# EAGLE design hzbcpu1 (EAGLE 7.6.0)
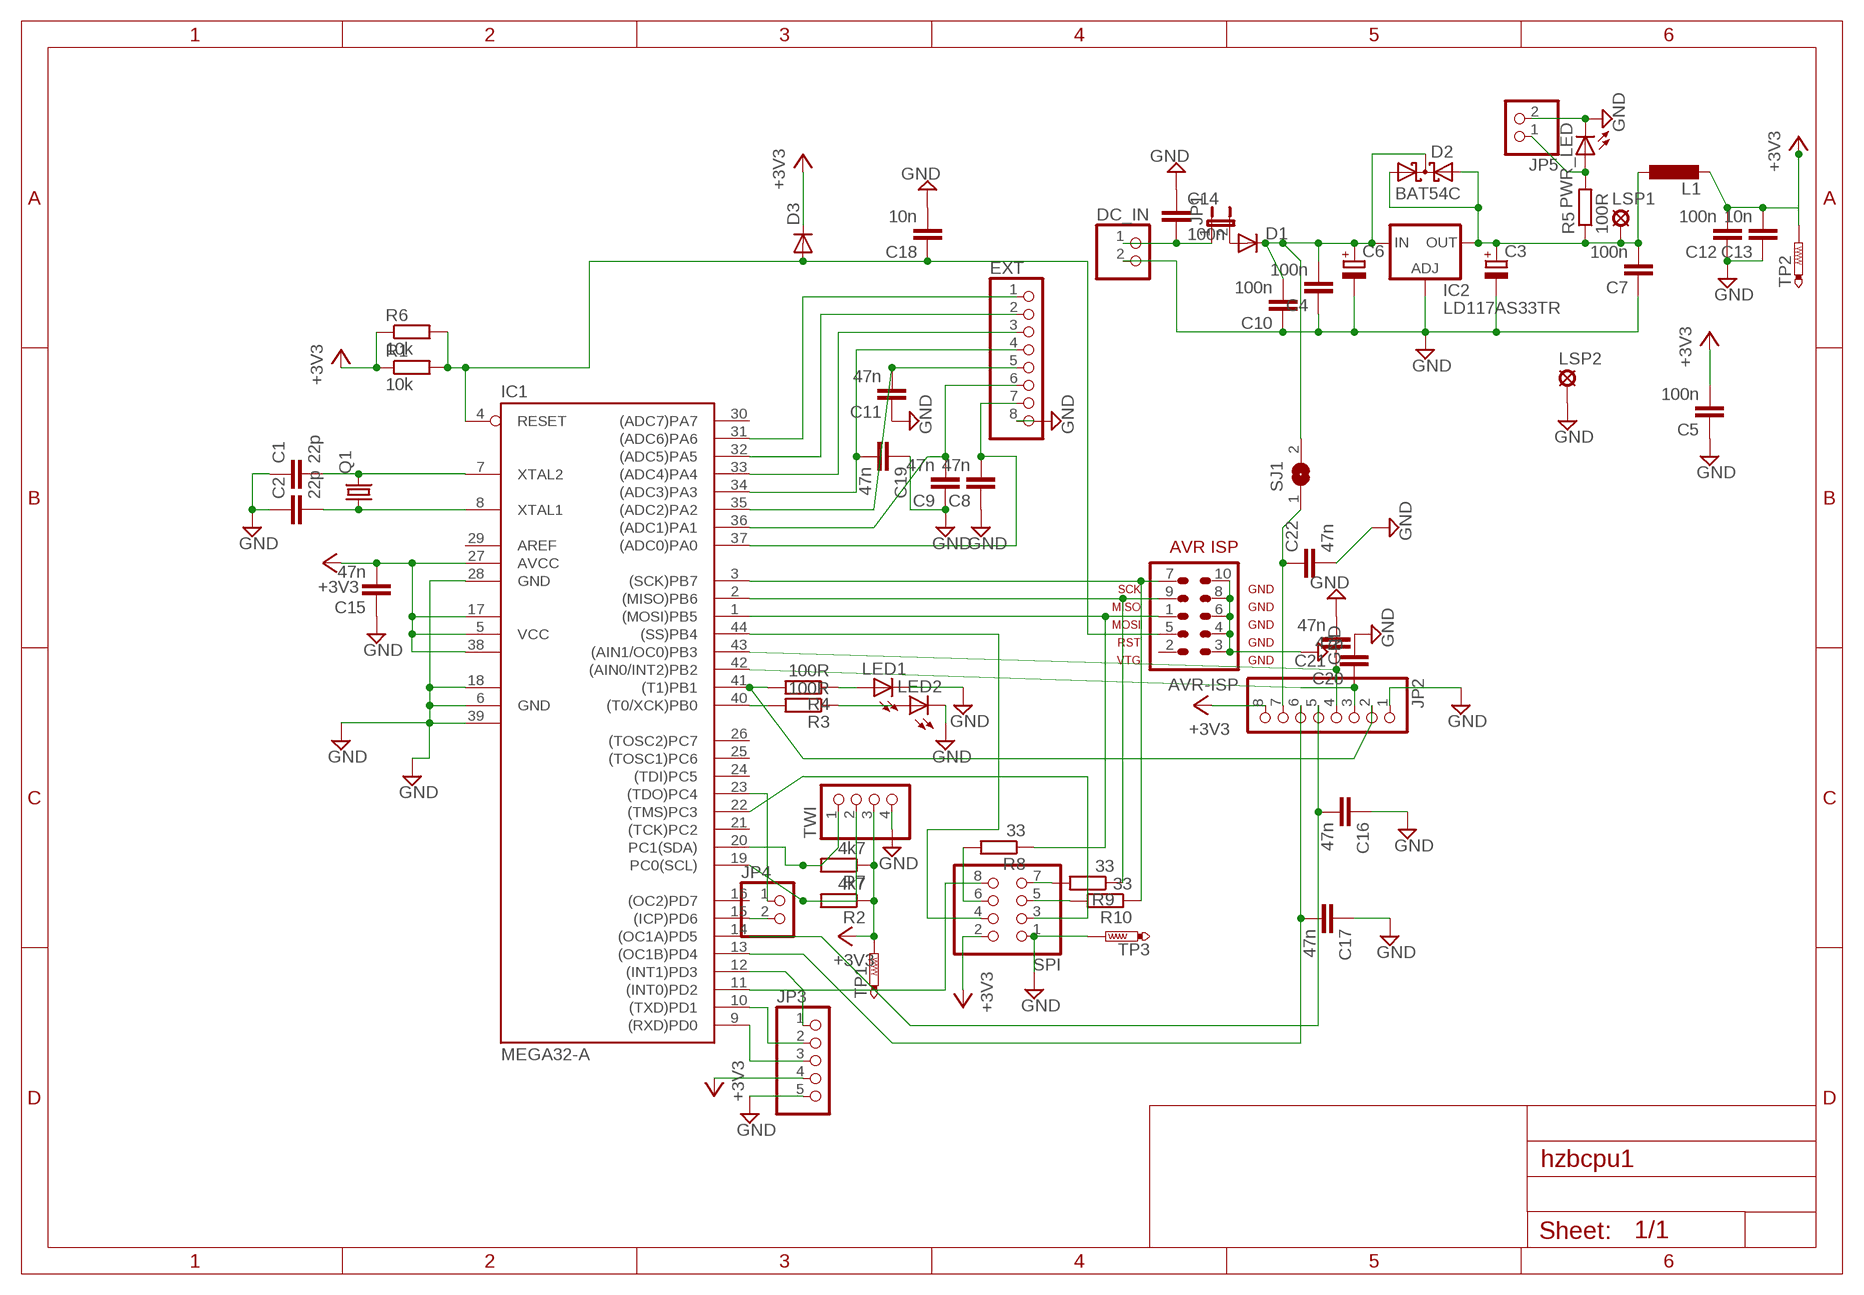
[diagram p0: schematic, sheet 1]

## Parts
AVR-ISP  AVR-ISP-10  [AVR-ISP-10]
C1  22p  C-EUC1206  [C1206]
C2  22p  C-EUC1206  [C1206]
C3  CPOL-EUSMCD  [SMC_D]
C4  100n  C-EUC1206  [C1206]
C5  100n  C-EUC0805  [C0805]
C6  CPOL-EUSMCD  [SMC_D]
C7  100n  C-EUC1206  [C1206]
C8  47n  C-EUC1206  [C1206]
C9  47n  C-EUC1206  [C1206]
C10  100n  C-EUC1206  [C1206]
C11  47n  C-EUC1206  [C1206]
C12  100n  C-EUC1206  [C1206]
C13  10n  C-EUC0805  [C0805]
C14  100n  C-EUC1206  [C1206]
C15  47n  C-EUC1206  [C1206]
C16  47n  C-EUC0805  [C0805]
C17  47n  C-EUC0805  [C0805]
C18  10n  C-EUC0805  [C0805]
C19  47n  C-EUC1206  [C1206]
C20  47n  C-EUC1206  [C1206]
C21  47n  C-EUC1206  [C1206]
C22  47n  C-EUC1206  [C1206]
D1  DIODE-DO214AA  [DO214AA]
D2  BAT54C  [SOT23]
D3  DIODE-DO214AA  [DO214AA]
DC_IN  PINHD-1X2  [1X02]
EXT  PINHD-1X8  [1X08]
IC1  MEGA32-A  [TQFP44]
IC2  LD117AS33TR  [SOT223]
JP1  JP1E  [JP1]
JP2  PINHD-1X8  [1X08]
JP3  PINHD-1X5  [1X05]
JP4  PINHD-1X2  [1X02]
JP5  PINHD-1X2  [1X02]
L1  L-EUL3225M  [L3225M]
LED1  LED3MM  [LED3MM]
LED2  LED3MM  [LED3MM]
LSP1  LSP11  [LSP11]
LSP2  LSP11  [LSP11]
PWR_LED  LED3MM  [LED3MM]
Q1  CRYSTALHC49UP  [HC49UP]
R1  10k  R-EU_0204/7  [0204/7]
R2  4k7  R-EU_R1206  [R1206]
R3  100R  R-EU_R1206  [R1206]
R4  100R  R-EU_R1206  [R1206]
R5  100R  R-EU_R1206  [R1206]
R6  10k  R-EU_R1206  [R1206]
R7  4k7  R-EU_R1206  [R1206]
R8  33  R-EU_R0805  [R0805]
R9  33  R-EU_R0805  [R0805]
R10  33  R-EU_R1206  [R1206]
SJ1  SJ  [SJ]
SPI  PINHD-2X4  [2X04]
TP1  PTR1B1,27  [B1,27]
TP2  PTR1B1,27  [B1,27]
TP3  PTR1B1,27  [B1,27]
TWI  PINHD-1X4  [1X04]

## Nets
+3V3: C5.2 C12.2 C13.2 C15.2 D3.C IC1.5(VCC) IC1.17(VCC1) IC1.27(AVCC) IC1.38(VCC2) JP2.8 JP3.4 L1.2 R1.1 R2.1 R6.1 R7.1 SPI.2 TP1.TP TP2.TP TWI.3
GND: AVR-ISP.3 AVR-ISP.4 AVR-ISP.6 AVR-ISP.8 AVR-ISP.10 C1.1 C2.1 C3.- C4.1 C5.1 C6.- C7.1 C8.1 C9.1 C10.1 C11.1 C12.1 C13.1 C14.1 C15.1 C16.1 C17.1 C18.2 C19.1 C20.2 C21.2 C22.2 DC_IN.2 EXT.8 IC1.6(GND) IC1.18(GND1) IC1.28(GND) IC1.39(GND2) IC2.1(ADJ) JP2.1 JP3.5 JP5.2 LED1.K(C) LED2.K(C) LSP2.MP PWR_LED.K(C) SPI.1 TP3.TP TWI.4
N$1: AVR-ISP.5 C18.1 D3.A IC1.4(RESET) R1.2 R6.2
N$2: R8.2 SPI.6
N$3: C2.2 IC1.8(XTAL1) Q1.1
N$4: C1.2 IC1.7(XTAL2) Q1.2
N$5: R9.2 SPI.7
N$6: AVR-ISP.7 IC1.3((SCK)PB7) R10.1
N$7: EXT.1 IC1.31((ADC6)PA6)
N$8: IC1.20(PC1(SDA)) R7.2 TWI.1
N$9: IC1.40((T0/XCK)PB0) R3.2
N$10: C4.2 C6.+ C10.2 D1.C D2.3(CC) IC2.3(IN) SJ1.2
N$11: IC1.19(PC0(SCL)) R2.2 TWI.2
N$12: IC1.11((INT0)PD2) SPI.8
N$13: C14.2 DC_IN.1 JP1.1
N$14: C20.1 IC1.42((AIN0/INT2)PB2) JP2.3
N$15: IC1.9((RXD)PD0) JP3.3
N$16: C19.2 EXT.4 IC1.34((ADC3)PA3)
N$17: EXT.3 IC1.33((ADC4)PA4)
N$18: EXT.2 IC1.32((ADC5)PA5)
N$19: C21.1 IC1.43((AIN1/OC0)PB3) JP2.4
N$20: C8.2 EXT.7 IC1.37((ADC0)PA0)
N$21: D1.A JP1.2
N$22: C9.2 EXT.6 IC1.36((ADC1)PA1)
N$23: IC1.41((T1)PB1) JP2.2 R4.2
N$24: C11.2 EXT.5 IC1.35((ADC2)PA2)
N$25: IC1.10((TXD)PD1) JP3.2
N$26: IC1.44((SS)PB4) SPI.4
N$27: JP5.1 PWR_LED.A R5.2
N$28: LED2.A R3.1
N$29: AVR-ISP.1 IC1.1((MOSI)PB5) R8.1
N$30: AVR-ISP.9 IC1.2((MISO)PB6) R9.1
N$31: R10.2 SPI.5
N$32: C17.2 IC1.13((OC1B)PD4) JP2.6
N$33: C16.2 IC1.14((OC1A)PD5) JP2.5
N$34: C3.+ C7.2 D2.1(A1) D2.2(A2) IC2.4(OUT) L1.1 LSP1.MP R5.1
N$35: LED1.A R4.1
N$36: IC1.15((ICP)PD6) JP4.2
N$37: IC1.22((TMS)PC3) SPI.3
N$38: C22.1 JP2.7 SJ1.1
N$39: IC1.23((TDO)PC4) JP4.1
N$40: IC1.12((INT1)PD3) JP3.1
Unconnected: AVR-ISP.2 IC1.16((OC2)PD7) IC1.21((TCK)PC2) IC1.24((TDI)PC5) IC1.25((TOSC1)PC6) IC1.26((TOSC2)PC7) IC1.29(AREF) IC1.30((ADC7)PA7)

## Library data of the parts
AVR-ISP = avr-6:AVR-ISP-10: AVR ISP-10 Serial Programming Header
C1 C2 C4 C5 C7-C22 = rcl:C-EU: CAPACITOR, European symbol
C3 C6 = rcl:CPOL-EU: POLARIZED CAPACITOR, European symbol
D1 D3 = diode:DIODE-: DIODE
D2 = diode:BAT54C: Schottky Diodes Source: Fairchild .. BAT54.pdf
DC_IN JP4 JP5 = pinhead:PINHD-1X2: PIN HEADER
EXT JP2 = pinhead:PINHD-1X8: PIN HEADER
IC1 = atmel:MEGA32: MICROCONTROLLER 32 Kbytes FLASH 2 Kbytes SRAM 1 Kbytes EEPROM USART 8-channel 10 bit ADC Source: www.atmel.com .. doc2503.pdf; MPN: ATMEGA32-16AU; OC_FARNELL: 9171274; OC_NEWARK: 69K6677
IC2 = v-reg:LD117A?*: Low drop fixed and adjustable positive voltage regulators 1 A Source: http://www.st.com/stonline/products/literature/ds/7194/ld1117axx.pdf
JP1 = jumper:JP1E: JUMPER
JP3 = pinhead:PINHD-1X5: PIN HEADER
L1 = rcl:L-EU: INDUCTOR, European symbol
LED1 LED2 PWR_LED = led:LED: LED OSRAM: - CHIPLED LG R971, LG N971, LY N971, LG Q971, LY Q971, LO R971, LY R971 LH N974, LH R974 LS Q976, LO Q976, LY Q976 LO Q996 - Hyper CHIPLED LW Q18S LB Q993, LB Q99A, LB R99A - SideLED LS A670, LO A670, LY A670, LG A670, LP A670 LB A673, LV A673, LT A673, LW A673 LH A674 LY A675 LS A676, LA A676, LO A676, LY A676, LW A676 LS A679, LY A679, LG A679 - Hyper Micro SIDELED® LS Y876, LA Y876, LO Y876, LY Y876 LT Y87S - SmartLED LW L88C, LW L88S LB L89C, LB L89S, LG L890 LS L89K, LO L89K, LY L89K LS L896, LA L896, LO L896, LY L896 - TOPLED LS T670, LO T670, LY T670, LG T670, LP T670 LSG T670, LSP T670, LSY T670, LOP T670, LYG T670 LG T671, LOG T671, LSG T671 LB T673, LV T673, LT T673, LW T673 LH T674 LS T676, LA T676, LO T676, LY T676, LB T676, LH T676, LSB T676, LW T676 LB T67C, LV T67C, LT T67C, LS T67K, LO T67K, LY T67K, LW E67C LS E67B, LA E67B, LO E67B, LY E67B, LB E67C, LV E67C, LT E67C LW T67C LS T679, LY T679, LG T679 LS T770, LO T770, LY T770, LG T770, LP T770 LB T773, LV T773, LT T773, LW T773 LH T774 LS E675, LA E675, LY E675, LS T675 LS T776, LA T776, LO T776, LY T776, LB T776 LHGB T686 LT T68C, LB T68C - Hyper Mini TOPLED® LB M676 - Mini TOPLED Santana® LG M470 LS M47K, LO M47K, LY M47K Source: http://www.osram.convergy.de LUXEON: - LUMILED® LXK2-PW12-R00, LXK2-PW12-S00, LXK2-PW14-U00, LXK2-PW14-V00 LXK2-PM12-R00, LXK2-PM12-S00, LXK2-PM14-U00 LXK2-PE12-Q00, LXK2-PE12-R00, LXK2-PE12-S00, LXK2-PE14-T00, LXK2-PE14-U00 LXK2-PB12-K00, LXK2-PB12-L00, LXK2-PB12-M00, LXK2-PB14-N00, LXK2-PB14-P00, LXK2-PB14-Q00 LXK2-PR12-L00, LXK2-PR12-M00, LXK2-PR14-Q00, LXK2-PR14-R00 LXK2-PD12-Q00, LXK2-PD12-R00, LXK2-PD12-S00 LXK2-PH12-R00, LXK2-PH12-S00 LXK2-PL12-P00, LXK2-PL12-Q00, LXK2-PL12-R00 Source: www.luxeon.com KINGBRIGHT: KA-3528ASYC Source: www.kingbright.com
LSP1 LSP2 = solpad:LSP11: SOLDER PAD drill 1.1 mm
Q1 = crystal:CRYSTAL: CRYSTAL; OC_FARNELL: unknown; OC_NEWARK: unknown
R1-R10 = rcl:R-EU_: RESISTOR, European symbol
SJ1 = jumper:SJ: SMD solder JUMPER
SPI = pinhead:PINHD-2X4: PIN HEADER
TP1-TP3 = testpad:PTR1: TEST PIN
TWI = pinhead:PINHD-1X4: PIN HEADER

## Board
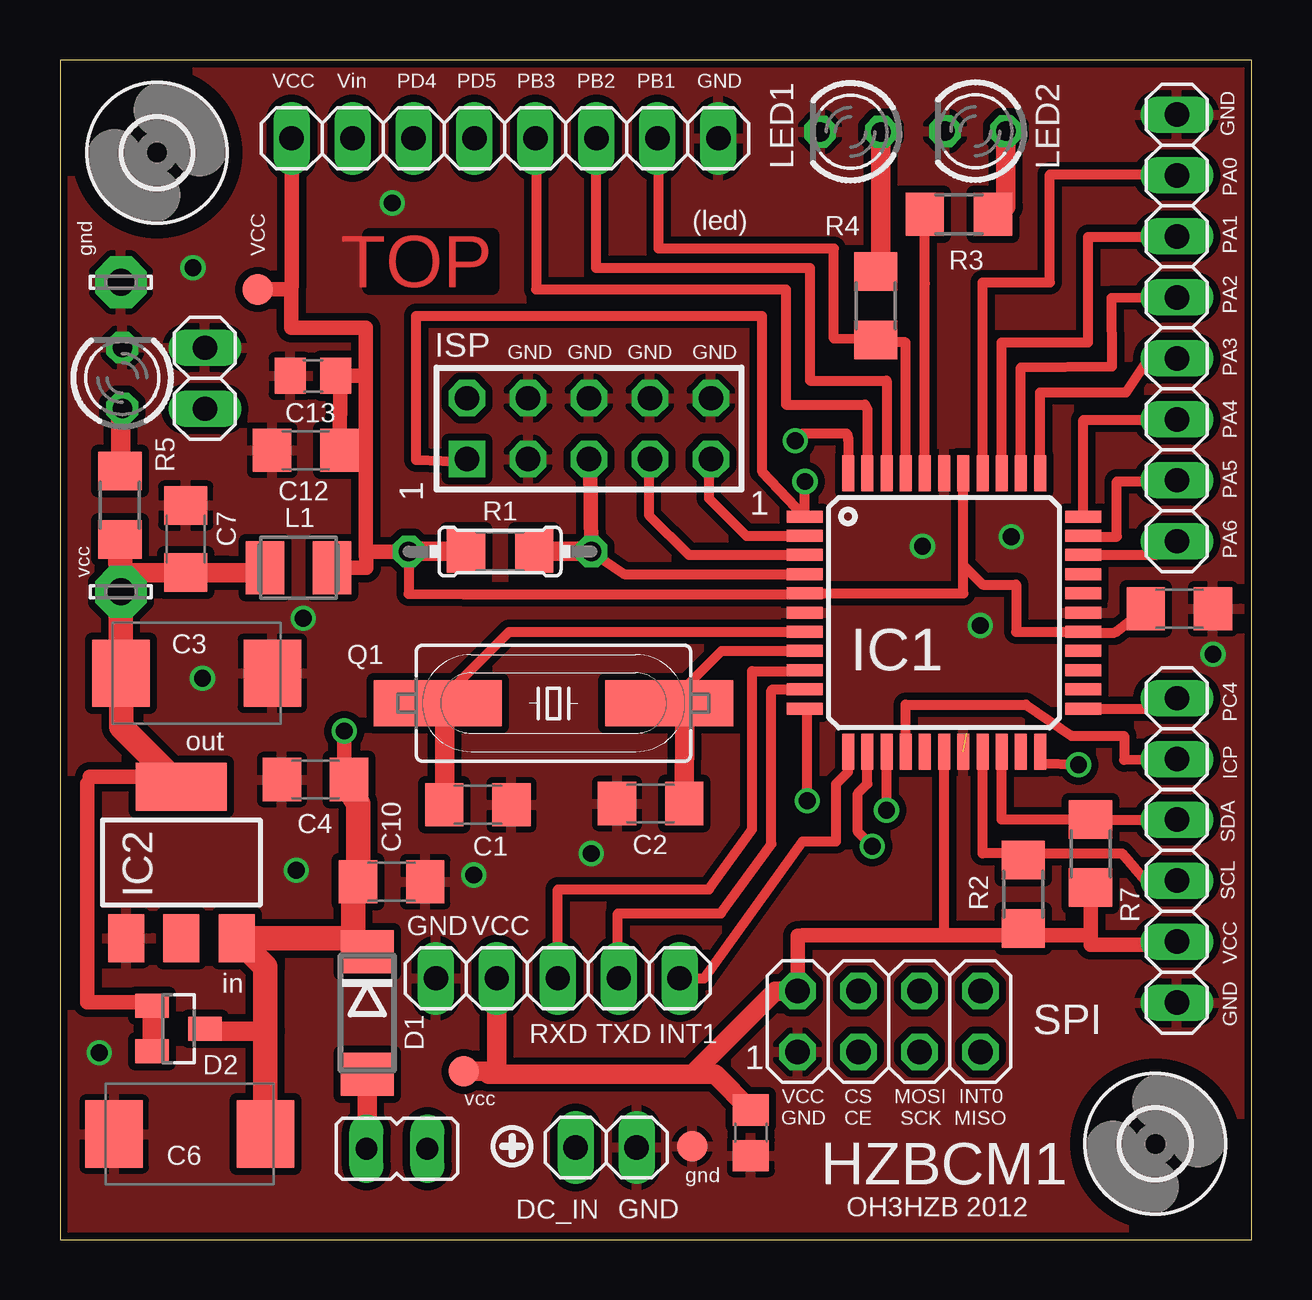
[diagram p1: board, top side]
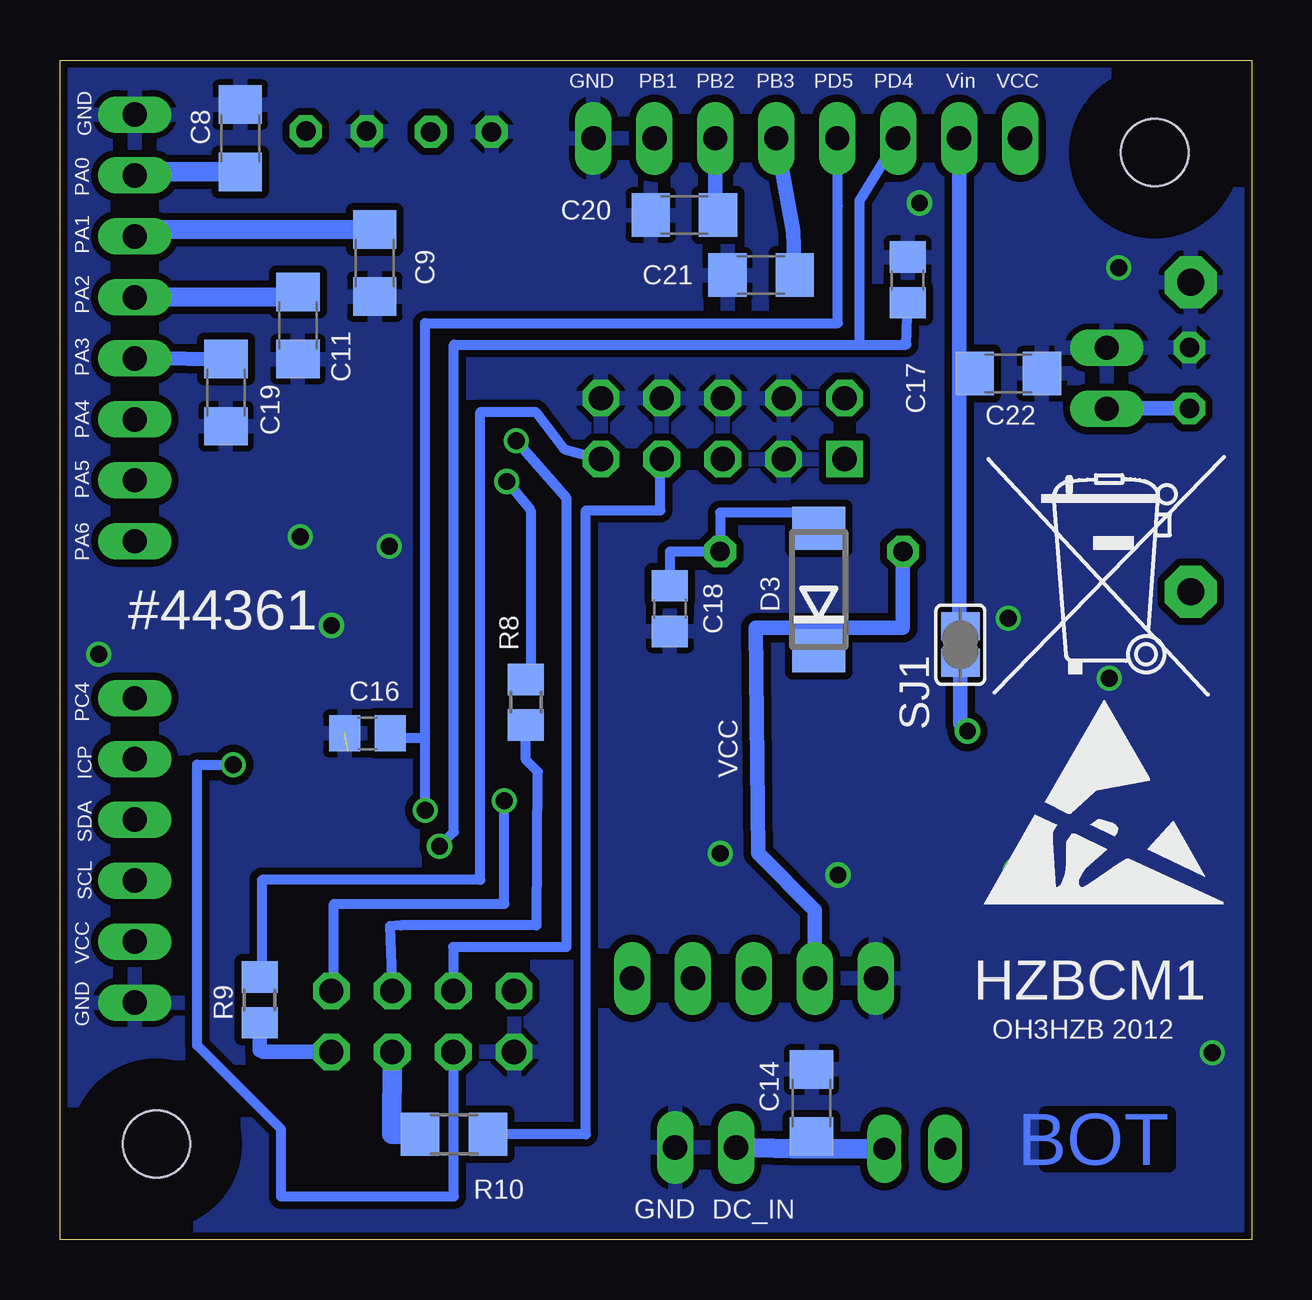
[diagram p2: board, bottom side, seen from below]

Size 49.65 x 49.15 mm. Coordinates in mm from the lower left corner, seen from the top.
Outline: 0,0 49.65,0 49.65,49.15 0,49.15 0,0
Copper layers (1*16): Top 0.035mm / dielectric 1.5mm / Bottom 0.035mm
Design rules "Fusion_eagle_rule_v1.1 *": minimum track width 6mil, minimum drill 12mil, track to track 12mil, track to pad 12mil, pad to pad 10mil, via to via 6mil, smd to smd 0mil, copper to edge 12mil, drill to drill 10mil, minimum pad ring 10mil, minimum via ring 6mil, stop-mask expansion 2mil, vias tented up to drill 100mil, thermal gap 10mil

### Footprints (pad centres in the part's own frame; a part is rotated, then mirrored left to right if it is on the bottom)
AVR-ISP-10 = drill 1.016 square: 1 -5.08,-1.27 | drill 1.016 octagon: 2 -5.08,1.27; 3 -2.54,-1.27; 4 -2.54,1.27; 5 0,-1.27; 6 0,1.27; 7 2.54,-1.27; 8 2.54,1.27; 9 5.08,-1.27; 10 5.08,1.27
C1206 = smd 1.6 x 1.8: 1 -1.4,0; 2 1.4,0
SMC_D = smd 2.4 x 2.8: + -3.15,0; - 3.15,0
C0805 = smd 1.3 x 1.5: 1 -0.95,0; 2 0.95,0
DO214AA = smd 1.8 x 2.2: A 2.55,0; C -2.55,0
SOT23 = smd 1 x 1.4: 1 -0.95,-1.1; 2 0.95,-1.1; 3 0,1.1
1X02 = drill 1.016 long: 1 -1.27,0; 2 1.27,0
1X08 = drill 1.016 long: 1 -8.89,0; 2 -6.35,0; 3 -3.81,0; 4 -1.27,0; 5 1.27,0; 6 3.81,0; 7 6.35,0; 8 8.89,0
TQFP44 = smd 1.5 x 0.5: 1 -5.8,4; 2 -5.8,3.2; 3 -5.8,2.4; 4 -5.8,1.6; 5 -5.8,0.8; 6 -5.8,0; 7 -5.8,-0.8; 8 -5.8,-1.6; 9 -5.8,-2.4; 10 -5.8,-3.2; 11 -5.8,-4; 23 5.8,-4; 24 5.8,-3.2; 25 5.8,-2.4; 26 5.8,-1.6; 27 5.8,-0.8; 28 5.8,0; 29 5.8,0.8; 30 5.8,1.6; 31 5.8,2.4; 32 5.8,3.2; 33 5.8,4 | smd 0.5 x 1.5: 12 -4,-5.8; 13 -3.2,-5.8; 14 -2.4,-5.8; 15 -1.6,-5.8; 16 -0.8,-5.8; 17 0,-5.8; 18 0.8,-5.8; 19 1.6,-5.8; 20 2.4,-5.8; 21 3.2,-5.8; 22 4,-5.8; 34 4,5.8; 35 3.2,5.8; 36 2.4,5.8; 37 1.6,5.8; 38 0.8,5.8; 39 0,5.8; 40 -0.8,5.8; 41 -1.6,5.8; 42 -2.4,5.8; 43 -3.2,5.8; 44 -4,5.8
SOT223 = smd 1.5 x 2: 1 -2.3,-3.15; 2 0,-3.15; 3 2.3,-3.15 | smd 3.8 x 2: 4 0,3.15
JP1 = drill 0.914 long: 1 0,-1.27; 2 0,1.27
1X05 = drill 1.016 long: 1 -5.08,0; 2 -2.54,0; 3 0,0; 4 2.54,0; 5 5.08,0
L3225M = smd 1.6 x 2.2: 1 -1.4,0; 2 1.4,0
LED3MM = drill 0.813 octagon: A -1.27,0; K 1.27,0
LSP11 = drill 1.118 pad 2.159 octagon: MP 0,0
HC49UP = smd 5.334 x 1.93: 1 -4.826,0; 2 4.826,0
0204/7 = drill 0.813 octagon: 1 -3.81,0; 2 3.81,0
R1206 = smd 1.6 x 1.803: 1 -1.422,0; 2 1.422,0
R0805 = smd 1.3 x 1.5: 1 -0.95,0; 2 0.95,0
SJ = smd 1.168 x 1.6: 1 -0.762,0; 2 0.762,0
2X04 = drill 1.016 octagon: 1 -3.81,-1.27; 2 -3.81,1.27; 3 -1.27,-1.27; 4 -1.27,1.27; 5 1.27,-1.27; 6 1.27,1.27; 7 3.81,-1.27; 8 3.81,1.27
B1,27 = smd 1.27 x 1.27: TP 0,0
1X04 = drill 1.016 long: 1 -3.81,0; 2 -1.27,0; 3 1.27,0; 4 3.81,0
2,8 = hole 2.8: 0,0

### Placement (x,y rotation side)
AVR-ISP  22.04,33.79 0 top
C1  17.41,18.12 180 top
C2  24.61,18.17 0 top
C3  5.7,23.6 0 top
C4  10.65,19.17 0 top
C5  28.79,4.45 90 top
C6  5.41,4.4 180 top
C7  5.24,29.19 270 top
C8  42.14,45.89 270 bottom
C9  36.54,40.69 90 bottom
C10  13.82,14.92 180 top
C11  39.74,38.09 90 bottom
C12  10.24,32.89 0 top
C13  10.54,35.99 0 top
C14  18.34,5.69 270 bottom
C15  46.64,26.29 180 top
C16  36.84,21.09 0 bottom
C17  14.34,39.99 270 bottom
C18  24.24,26.29 270 bottom
C19  42.74,35.29 90 bottom
C20  23.64,42.69 180 bottom
C21  20.44,40.19 180 bottom
C22  10.14,36.09 0 bottom
D1  12.8,9.44 270 top
D2  4.94,8.79 270 top
D3  18.04,27.09 90 bottom
DC_IN  22.75,3.84 0 top
EXT  46.54,37.99 90 top
IC1  36.84,26.13 0 top
IC2  5.06,15.72 0 top
JP1  14.04,3.79 90 top
JP2  18.54,45.89 180 top
JP3  20.74,10.89 180 top
JP4  46.54,21.29 270 top
JP5  6.04,35.89 90 top
L1  9.94,27.99 0 top
LED1  32.94,46.16 180 top
LED2  38.14,46.19 180 top
LSP1  2.54,26.99 0 top
LSP2  2.54,39.89 0 top
PWR_LED  2.6,35.91 90 top
Q1  20.56,22.35 180 top
R1  18.34,28.67 0 top
R2  40.14,14.39 90 top
R3  37.45,42.73 180 top
R4  33.99,38.92 270 top
R5  2.5,30.6 90 top
R6  18.34,28.69 0 top
R7  42.94,16.09 90 top
R8  30.24,22.39 270 bottom
R9  41.34,9.99 270 bottom
R10  33.24,4.39 180 bottom
SJ1  12.14,24.79 270 bottom
SPI  34.54,9.09 0 top
TP1  16.83,7.01 90 top
TP2  8.24,39.59 0 top
TP3  26.34,3.89 0 top
TWI  46.54,13.69 270 top
U$1  [2,8]  4.04,45.29 0 top
U$2  [2,8]  45.64,3.99 0 top
U$3  [ESD_10.00]  11.24,13.89 0 bottom
U$4  [MUELLTONNE_10.00]  11.64,22.29 0 bottom
U$5  [ICON_PLUS]  18.84,3.89 0 top

### Tracks (layer width: path | path; a pad name or v marks a point on that pad's centre or on a via)
+3V3
  Top 0.406: R1.1 14.52,26.91 16.84,26.89 31,26.89 IC1.5 37.64,26.93 37.64,28.09 | IC1.17 36.84,12.69 | 46.44,12.29 46.34,12.39 | 30.74,12.67 30.94,12.69 | C15.2 43.94,25.29 42.68,25.29 IC1.27 39.84,25.33 39.84,27.29 38.44,27.29 37.64,28.09 | 37.64,28.09 IC1.38
  Top 0.61: R1.1 12.74,28.67 | TWI.3 46.57,12.22 46.34,12.39 | 40.34,12.69 42.94,12.69 | 42.94,12.69 42.94,12.29 46.44,12.29 | SPI.2 30.74,12.67 | 42.94,12.69 R7.1 | 40.34,12.69 R2.1 | 40.34,12.69 36.84,12.69 30.94,12.69 | 12.74,28.67 12.74,35.99 | 12.74,28.67 12.75,28.2 12.75,27.99 L1.2 | 12.74,35.99 12.74,37.99 9.64,37.99 9.64,39.59 | 9.64,39.59 TP2.TP | JP2.8 9.65,39.78 9.64,39.59 | C12.2 11.69,35.79 C13.2 12.74,35.99
  Top 0.813: R6.1 14.52,28.69 R1.1 | TP1.TP 17.74,7.01 | 17.74,7.01 18.2,7.01 JP3.4 | SPI.2 29.81,10.36 26.34,6.89 | 26.34,6.89 17.86,6.89 17.74,7.01 | 26.34,6.89 27.3,6.89 C5.2
  Bottom 0.406: 20.57,16.09 20.67,17.44 | D3.C 17.94,24.84 17.94,25.49
  Bottom 0.61: R1.1 14.54,25.49 17.94,25.49 20.67,25.49 20.57,16.09 18.2,13.72 JP3.4
GND  (via drill 0.7)  (1 unrouted)
  other vias: 5.54,40.49 9.84,15.39 22.14,16.09 17.24,15.19 5.94,23.39 13.84,43.19 1.64,7.79 39.64,29.29 38.34,25.59 10.14,25.89 48.04,24.39 35.94,28.89
  pour Top: 0.44,48.82 49.67,48.82 49.72,0.34 0.49,0.34
  pour Bottom: 0.54,48.92 49.26,48.66 49.67,0.48 0.59,0.44
N$1
  Top 0.406: IC1.4 23.51,27.73 R1.2 | 22.09,32.33 arc28 AVR-ISP.5
  Top 0.61: R1.2 22.09,32.33
  Top 0.813: R6.2 22.14,28.69 R1.2
  Bottom 0.406: 18.04,30.29 22.14,30.29 R1.2 24.24,28.67 C18.1 | 17.84,30.29 18.04,30.29 | 18.04,30.29 D3.A
N$2
  Bottom 0.406: R8.2 30.24,19.99 29.74,19.49 29.79,13.09 35.44,13.09 35.91,13.06 SPI.6
N$3
  Top 0.406: IC1.8 27.57,24.53 Q1.1
  Top 0.813: C2.2 26.04,21.79 25.48,22.35 Q1.1
N$4
  Top 0.406: IC1.7 18.71,25.33 Q1.2
  Top 0.813: C1.2 arc-90 16.04,17.89 16.04,21.79 Q1.2
N$5
  Bottom 0.406: 41.21,7.82 41.34,7.89
  Bottom 0.61: 41.34,7.89 R9.2 | SPI.7 41.21,7.82
N$6
  Top 0.406: IC1.3 26.2,28.53 24.54,30.19 24.54,32.48 AVR-ISP.7
  Bottom 0.406: AVR-ISP.7 24.64,32.52 24.64,30.39 27.74,30.39 27.74,4.39 R10.1
N$7
  Top 0.406: IC1.31 45.67,28.53 EXT.1
N$8
  Top 0.406: 46.23,17.6 TWI.1 R7.2 39.24,17.51 IC1.20
N$9
  Top 0.406: IC1.40 36.04,39.84 R3.2
N$10  (via drill 0.7)
  Top 0.61: C4.2 11.84,19.38 v11.84,21.19
  Top 0.813: D2.3 6.14,8.69 8.56,8.69
  Top 1.016: C6.+ 8.56,8.69 8.56,11.37 IC2.3 12.23,12.57 | 12.23,12.57 D1.C | 12.23,12.57 12.23,14.86 C10.2 12.42,18.17 12.04,18.79 12.34,18.9 C4.2
  Bottom 0.61: v11.84,21.19 12.14,21.49 SJ1.2
N$11
  Top 0.406: IC1.19 38.44,18.09 38.44,16.09 40.04,16.09 | TWI.2 45.21,14.96 44.24,16.09 40.04,16.09 | R2.2 40.04,16.09
N$12  (via drill 0.7)
  Top 0.406: IC1.11 31.14,22.03 v31.14,18.29
  Bottom 0.406: v31.14,18.29 31.14,13.99 38.24,13.99 38.24,10.46 SPI.8
N$13
  Bottom 0.813: 19.13,3.79 DC_IN.1 | JP1.1 19.13,3.79 | 19.13,3.79 18.63,4.29 C14.2
N$14
  Top 0.406: IC1.42 34.44,35.79 31.24,35.79 31.24,40.49 22.34,40.49 22.34,45.8 JP2.3
  Bottom 0.61: C20.1 22.35,42.69 JP2.3
N$15
  Top 0.406: IC1.9 31.04,23.69 28.84,23.69 28.84,17.09 27.04,14.59 20.74,14.59 20.74,10.92
  Top 0.61: JP3.3 20.74,10.92
N$16
  Top 0.406: IC1.34 40.84,35.3 44.42,35.3 45.34,36.69 EXT.4
  Bottom 0.61: C19.2 46.04,36.72 EXT.4
N$17
  Top 0.406: IC1.33 42.64,34.16 45.02,34.16 EXT.3
N$18
  Top 0.406: IC1.32 42.64,29.29 44.04,29.29 44.04,31.59 46.29,31.59 EXT.2
N$19
  Top 0.406: IC1.43 33.64,34.59 33.54,34.79 30.24,34.79 30.24,39.59 19.84,39.59 19.84,45.86 JP2.4
  Bottom 0.61: C21.1 19.11,41.99 JP2.4
N$20
  Top 0.406: IC1.37 38.44,39.89 41.24,39.89 41.24,44.39 46.39,44.39 EXT.7
  Bottom 0.813: C8.2 45.79,44.49 EXT.7
N$21
  Top 0.813: JP1.2 12.8,3.82 D1.A
N$22
  Top 0.406: IC1.36 39.24,37.39 42.84,37.39 42.84,41.78 46.46,41.78 EXT.6
  Bottom 0.813: C9.2 45.95,42.08 45.96,41.78 EXT.6
N$23
  Top 0.406: IC1.41 35.24,37.39 33.64,37.39 33.69,37.19 arc-90 R4.2 32.24,37.55 32.24,41.29 24.94,41.29 24.94,45.09 JP2.2
N$24
  Top 0.406: IC1.35 40.04,36.34 43.84,36.39 43.82,39.24 EXT.5
  Bottom 0.813: C11.2 40.07,39.29 EXT.5
N$25
  Top 0.406: IC1.10 29.68,22.93 29.64,22.89 29.64,16.48 27.54,13.59 23.24,13.59 23.24,10.89 JP3.2
N$26  (via drill 0.7)
  Top 0.406: v30.64,33.29 30.94,33.59 32.78,33.59 32.84,33.33 IC1.44
  Bottom 0.406: v30.64,33.29 28.54,30.89 28.54,12.19 33.27,12.19 SPI.4
N$27
  Top 0.813: R5.2 2.54,32.09 2.54,34.64 PWR_LED.A
  Bottom 0.61: PWR_LED.A 6.03,34.64 JP5.1
N$28
  Top 0.813: R3.1 39.41,43.04 LED2.A
N$29  (via drill 0.7)
  Top 0.406: AVR-ISP.1 16.97,32.42 14.84,32.49 14.84,38.49 29.24,38.49 29.24,32.03 IC1.1 v31.04,31.59
  Bottom 0.406: v31.04,31.59 30.04,30.39 30.04,23.09 30.24,23.09 R8.1
N$30
  Top 0.406: IC1.2 28.6,29.33 27.04,30.89 27.04,32.44 AVR-ISP.9
  Bottom 0.406: AVR-ISP.9 28.64,32.94 29.84,34.49 32.14,34.49 32.14,14.99 41.24,14.99 41.24,10.69 41.39,10.99 R9.1
N$31
  Bottom 0.813: R10.2 35.84,4.39 SPI.5
N$32  (via drill 0.7)
  Top 0.406: IC1.13 33.64,18.99 33.24,18.59 33.24,16.99 v33.84,16.39
  Bottom 0.406: v33.84,16.39 33.24,16.99 33.24,37.29 16.34,37.29 | 16.34,37.29 16.34,43.29 JP2.6 | C17.2 14.39,37.29 16.34,37.29
N$33  (via drill 0.7)
  Top 0.406: IC1.14 v34.44,17.89
  Bottom 0.406: v34.44,17.89 34.44,20.89 | 34.44,20.89 34.44,38.19 17.24,38.19 17.24,43.06 JP2.5 | C16.2 35.89,20.89 34.44,20.89
N$34
  Top 0.406: D2.2 3.84,9.39 3.34,9.89 | 1.14,18.99 1.24,19.29
  Top 0.61: 3.34,9.89 1.14,9.89 1.14,18.99 | 1.24,19.29 4.64,19.29 | 7.99,27.79 L1.1 | LSP1.MP 2.54,27.68 2.52,27.69 | 6.94,27.79 6.74,27.79 6.74,27.89 6.94,27.89 6.94,27.79
  Top 0.813: 2.52,27.79 C7.2 6.94,27.79 7.99,27.79 8.44,27.79 | D2.2 D2.1
  Top 1.016: IC2.4 4.64,19.29 2.55,21.38 C3.+ 2.52,23.62 2.52,27.69 2.52,27.79 R5.1
N$35
  Top 0.813: LED1.A 34.19,40.66 R4.1
N$36
  Top 0.406: IC1.15 35.24,22.29 40.24,22.29 42.14,20.99 44.34,20.99 44.34,19.99 JP4.2
N$37  (via drill 0.7)
  Top 0.406: v42.44,19.79 40.84,19.83 IC1.22
  Bottom 0.406: SPI.3 33.24,7.65 33.24,1.79 40.44,1.79 40.44,4.59 43.94,8.09 43.94,19.79 v42.44,19.79
N$38
  Bottom 0.61: SJ1.1 12.19,25.6 12.19,36.09 | JP2.7 12.19,36.59 12.19,36.09 | 12.19,36.09 C22.1
N$39
  Top 0.406: IC1.23 46.54,22.13 JP4.1
N$40
  Top 0.406: IC1.12 32.84,19.49 32.34,18.99 32.34,16.59 30.94,16.59 26.84,10.89 JP3.1

### Text on the board
Top: TOP
Bottom: BOT
tNames: VCC | Vin | PD4 | PD5 | PB3 | PB2 | PB1 | GND | GND | PA0 | (led) | gnd | VCC | PA1 | PA2 | ISP | GND | GND | GND | GND | PA3 | PA4 | 1 | PA5 | 1 | PA6 | vcc | PC4 | out | ICP | SDA | SCL | GND | VCC | VCC | in | GND | RXD | TXD | INT1 | 1 | vcc | VCC | CE | CS | SCK | MOSI | INT0 | MISO | GND | gnd | HZBCM1 | DC_IN | OH3HZB 2012 | GND
bNames: VCC | Vin | PD4 | PD5 | PB3 | PB2 | PB1 | GND | GND | PA0 | PA1 | PA2 | PA3 | PA4 | PA5 | PA6 | #44361 | VCC | PC4 | ICP | SDA | SCL | VCC | HZBCM1 | OH3HZB 2012 | GND | DC_IN | GND